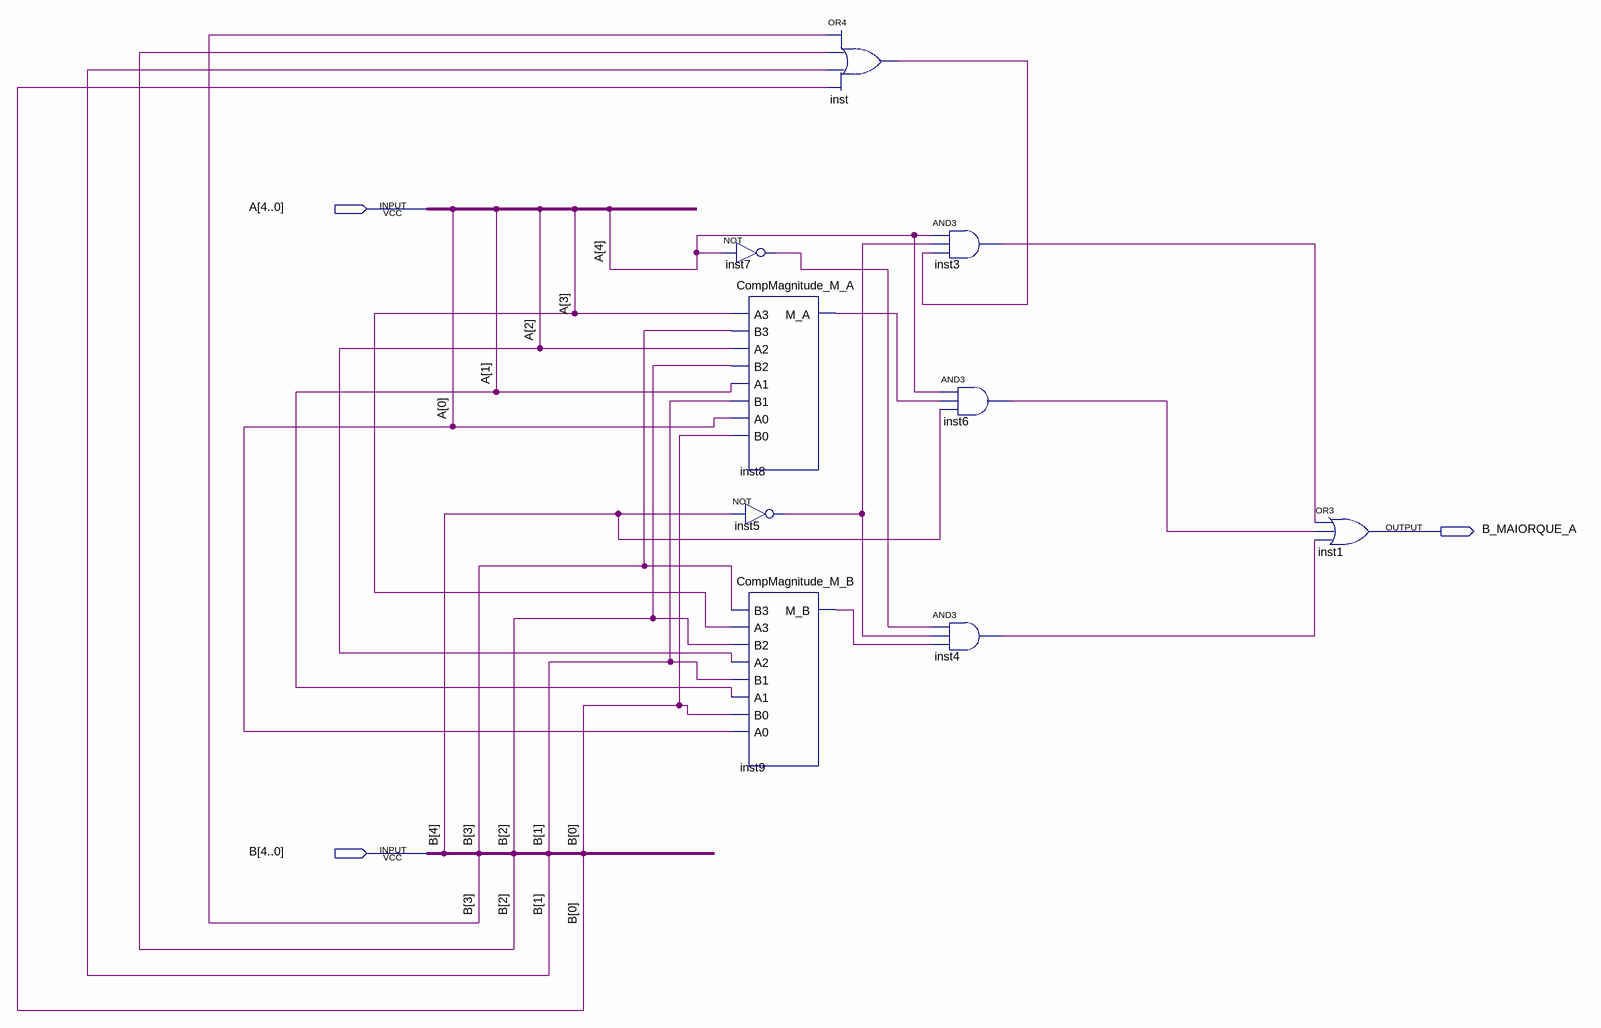
[diagram p0: schematic sheet]
// Quartus schematic M_B.bdf as structural Verilog: 9 symbols, 3 pins
module M_B (
  input  [4:0] A,
  input  [4:0] B,
  output B_MAIORQUE_A
);

  wire inst3_out, inst4_out, inst5_out, inst6_out, inst7_out, inst8_m_a, inst9_m_b, inst_out;

  not inst7 (inst7_out, A[4]);
  CompMagnitude_M_A inst8 (
    .A3(A[3]), .B3(B[3]), .A2(A[2]), .B2(B[2]), .A1(A[1]), .B1(B[1]), .A0(A[0]), .B0(B[0]), .M_A(inst8_m_a));
  not inst5 (inst5_out, B[4]);
  CompMagnitude_M_B inst9 (
    .B3(B[3]), .A3(A[3]), .B2(B[2]), .A2(A[2]), .B1(B[1]), .A1(A[1]), .B0(B[0]), .A0(A[0]), .M_B(inst9_m_b));
  or inst (inst_out, B[3], B[2], B[1], B[0]);
  and inst3 (inst3_out, A[4], inst5_out, inst_out);
  and inst6 (inst6_out, A[4], inst8_m_a, B[4]);
  and inst4 (inst4_out, inst7_out, inst5_out, inst9_m_b);
  or inst1 (B_MAIORQUE_A, inst3_out, inst6_out, inst4_out);
endmodule
